# Altium schematic sheet 海关全向控制器主控板电路V4_主控芯片.SchDoc
size A4
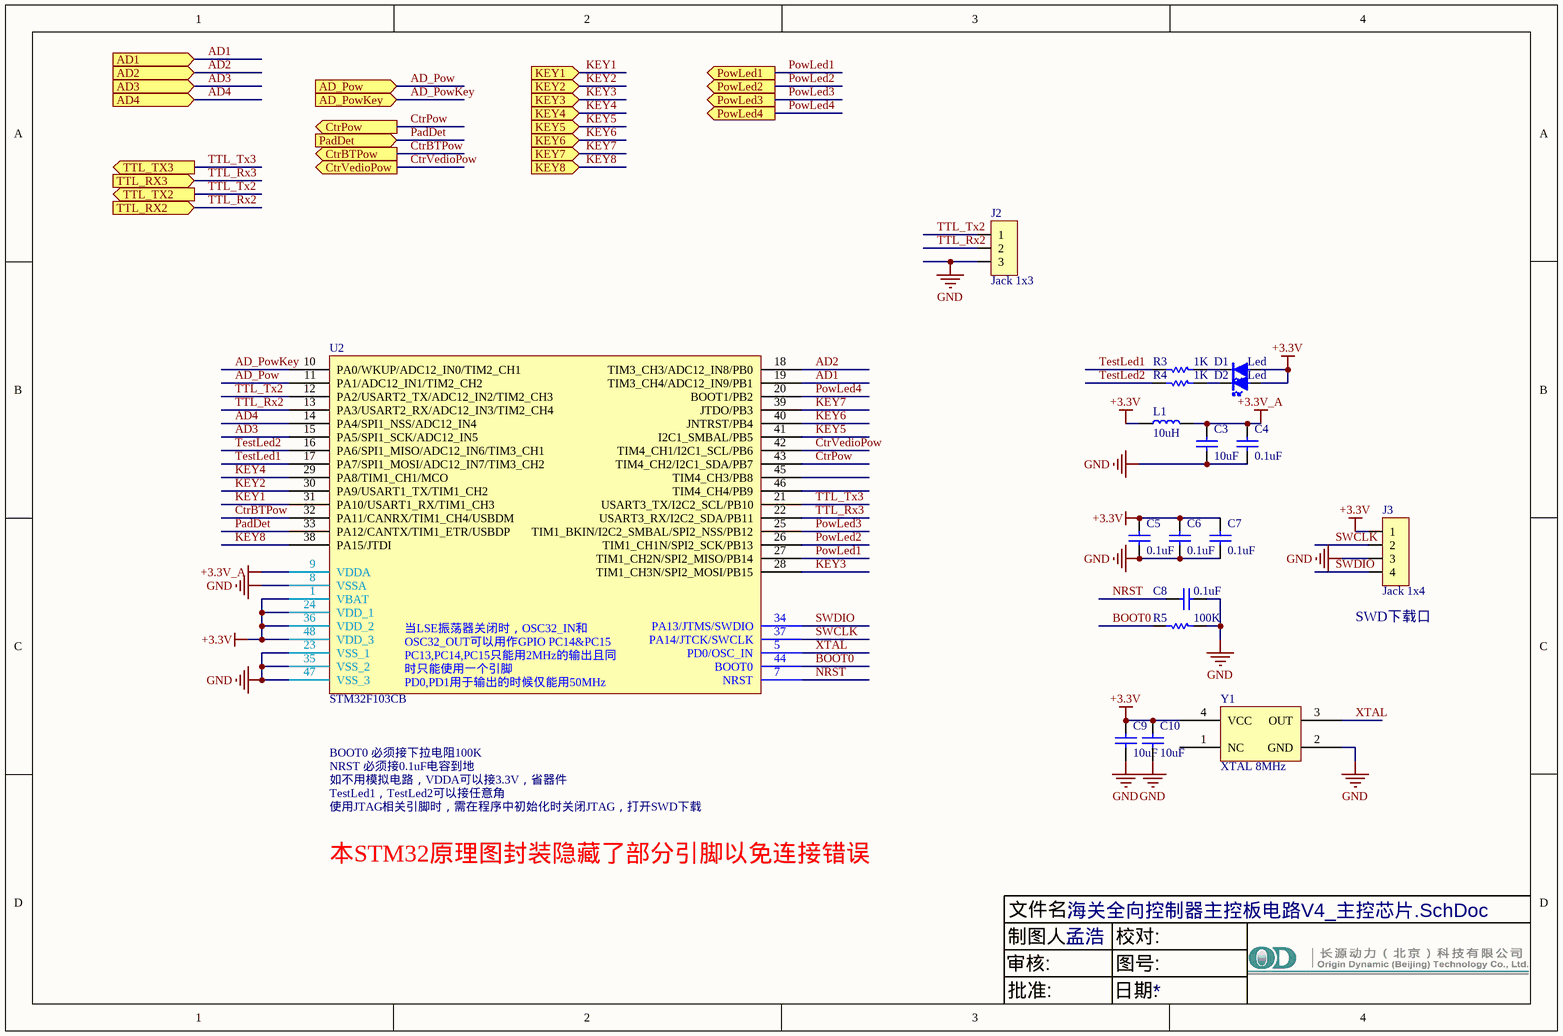
[diagram p0: 海关全向控制器主控板电路V4_主控芯片.SchDoc]

## Parts
C3  10uF  [C0805]
C4  0.1uF  [C0805]
C5  0.1uF  [C0805]
C6  0.1uF  [C0805]
C7  0.1uF  [C0805]
C8  0.1uF  [C0805]
C9  10uF  [C0805]
C10  10uF  [C0805]
D1  Led  [LED0805]
D2  Led  [LED0805]
J2  Jack 1x3  [Jk1*3-2.0]
J3  Jack 1x4  [Jk1*4-2.0]
L1  10uH  [L0805]
R3  1K  [R0805]
R4  1K  [R0805]
R5  100K  [R0805]
U2  STM32F103CB  [LQFP48]
Y1  XTAL 8MHz  [XTAL5032]

## Ports
AD1 (in), AD2 (in), AD3 (in), AD4 (in), AD_Pow (in), AD_PowKey (in), CtrBTPow (out), CtrPow (out), CtrVedioPow (out), KEY1 (in), KEY2 (in), KEY3 (in), KEY4 (in), KEY5 (in), KEY6 (in), KEY7 (in), KEY8 (in), PadDet (in), PowLed1 (out), PowLed2 (out), PowLed3 (out), PowLed4 (out), TTL_RX2 (in), TTL_RX3 (in), TTL_TX2 (out), TTL_TX3 (out)

## Nets
+3.3V: C5.1 C6.1 C7.1 C9.1 C10.1 D1.1(A) D2.1(A) J3.1 L1.1 U2.1(VBAT) U2.24(VDD_1) U2.36(VDD_2) U2.48(VDD_3) Y1.4(VCC)
+3.3V_A: C3.1 C4.1 L1.2 U2.9(VDDA)
GND: C3.2 C4.2 C5.2 C6.2 C7.2 C8.2 C9.2 C10.2 J2.3 J3.3 R5.2 U2.8(VSSA) U2.23(VSS_1) U2.35(VSS_2) U2.47(VSS_3) Y1.2(GND)
AD1: U2.19(TIM3_CH4/ADC12_IN9/PB1) ; port AD1
AD2: U2.18(TIM3_CH3/ADC12_IN8/PB0) ; port AD2
AD3: U2.15(PA5/SPI1_SCK/ADC12_IN5) ; port AD3
AD4: U2.14(PA4/SPI1_NSS/ADC12_IN4) ; port AD4
AD_Pow: U2.11(PA1/ADC12_IN1/TIM2_CH2) ; port AD_Pow
AD_PowKey: U2.10(PA0/WKUP/ADC12_IN0/TIM2_CH1) ; port AD_PowKey
BOOT0: R5.1 U2.44(BOOT0)
CtrBTPow: U2.32(PA11/CANRX/TIM1_CH4/USBDM) ; port CtrBTPow
CtrPow: U2.43(TIM4_CH2/I2C1_SDA/PB7) ; port CtrPow
CtrVedioPow: U2.42(TIM4_CH1/I2C1_SCL/PB6) ; port CtrVedioPow
KEY1: U2.31(PA10/USART1_RX/TIM1_CH3) ; port KEY1
KEY2: U2.30(PA9/USART1_TX/TIM1_CH2) ; port KEY2
KEY3: U2.28(TIM1_CH3N/SPI2_MOSI/PB15) ; port KEY3
KEY4: U2.29(PA8/TIM1_CH1/MCO) ; port KEY4
KEY5: U2.41(I2C1_SMBAL/PB5) ; port KEY5
KEY6: U2.40(JNTRST/PB4) ; port KEY6
KEY7: U2.39(JTDO/PB3) ; port KEY7
KEY8: U2.38(PA15/JTDI) ; port KEY8
NRST: C8.1 U2.7(NRST)
PadDet: U2.33(PA12/CANTX/TIM1_ETR/USBDP) ; port PadDet
PowLed1: U2.27(TIM1_CH2N/SPI2_MISO/PB14) ; port PowLed1
PowLed2: U2.26(TIM1_CH1N/SPI2_SCK/PB13) ; port PowLed2
PowLed3: U2.25(TIM1_BKIN/I2C2_SMBAL/SPI2_NSS/PB12) ; port PowLed3
PowLed4: U2.20(BOOT1/PB2) ; port PowLed4
SWCLK: J3.2 U2.37(PA14/JTCK/SWCLK)
SWDIO: J3.4 U2.34(PA13/JTMS/SWDIO)
TestLed1: R3.1 U2.17(PA7/SPI1_MOSI/ADC12_IN7/TIM3_CH2)
TestLed2: R4.1 U2.16(PA6/SPI1_MISO/ADC12_IN6/TIM3_CH1)
TTL_Rx2: J2.2 U2.13(PA3/USART2_RX/ADC12_IN3/TIM2_CH4) ; port TTL_RX2
TTL_Rx3: U2.22(USART3_RX/I2C2_SDA/PB11) ; port TTL_RX3
TTL_Tx2: J2.1 U2.12(PA2/USART2_TX/ADC12_IN2/TIM2_CH3) ; port TTL_TX2
TTL_Tx3: U2.21(USART3_TX/I2C2_SCL/PB10) ; port TTL_TX3
XTAL: U2.5(PD0/OSC_IN) Y1.3(OUT)
NetD1_2: D1.2(K) R3.2
NetD2_2: D2.2(K) R4.2

Not connected (* = marked no-connect by the designer): U2 2(PC13-TAMPER-RTC) 3(PC14-OSC32_IN) 4(PC15-OSC32_OUT) 6(PD1/OSC_OUT) 45(TIM4_CH3/PB8) 46(TIM4_CH4/PB9); Y1 1(NC)

## Notes on the sheet
- (near J3) SWD下载口
- BOOT0 必须接下拉电阻100K
- NRST 必须接0.1uF电容到地
- 如不用模拟电路，VDDA可以接3.3V，省器件
- TestLed1，TestLed2可以接任意角
- 使用JTAG相关引脚时，需在程序中初始化时关闭JTAG，打开SWD下载
- 本STM32原理图封装隐藏了部分引脚以免连接错误
- 文件名:
- 审核:
- 制图人:
- 孟浩
- 校对:
- 图号:
- 批准:
- 日期:
- (in symbol STM32F103Cx) OSC32_IN和OSC32_OUT可以用作通用IO PC14和PC15; PC13,PC14,PC15只能用于2MHz的输出模式且同时只能使用一个引脚; 当LSE振荡器关闭时，OSC32_IN和OSC32_OUT可以用作GPIO PC14&PC15 / PC13,PC14,PC15只能用2MHz的输出且同时只能使用一个引脚 / PD0,PD1用于输出的时候仅能用50MHz

## Library data of the parts
C3-C10 = CAP: Published: 8-Jun-2000; LatestRevisionDate: 17-Jul-2002; LatestRevisionNote: Re-released for DXP Platform.; PackageReference: RAD-0.3; Publisher: Altium Limited
D1 D2 = Led: light emitted diode
J2 = Jack 1x3: 插座
J3 = Jack 1x4: 插座
L1 = Inductor
R3-R5 = Res
U2 = STM32F103Cx
Y1 = XTAL